# Altium schematic sheet interface2.SchDoc
size A4
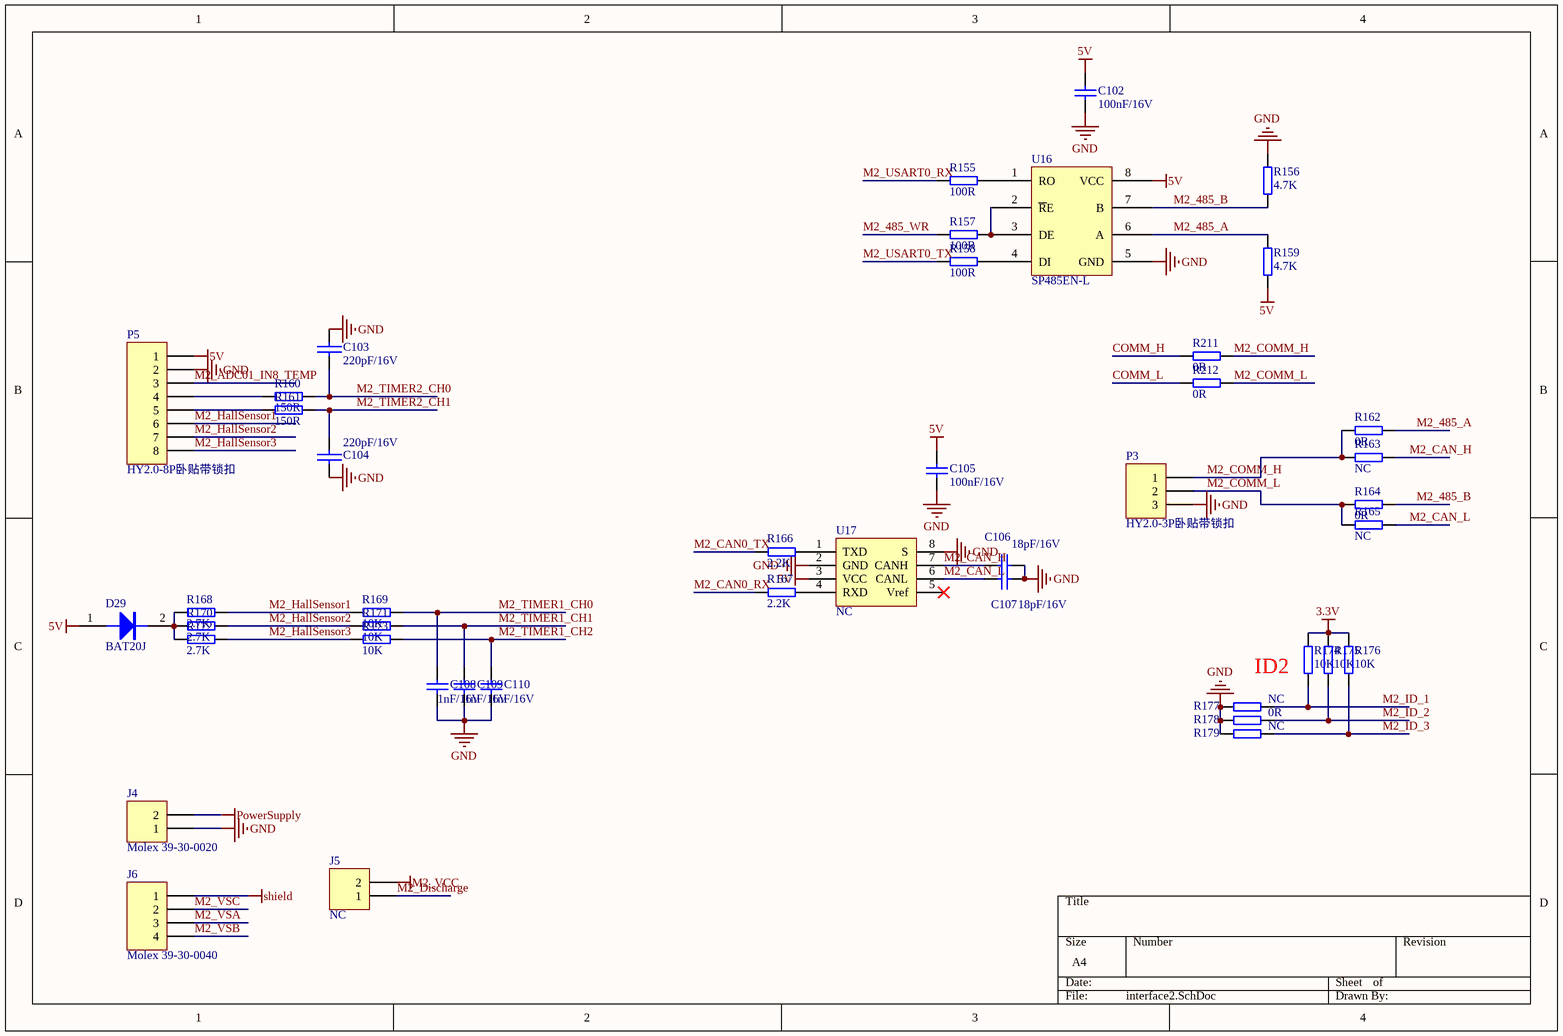
[diagram p0: interface2.SchDoc]

## Parts
C102  100nF/16V  [C0402]
C103  220pF/16V  [C0402]
C104  220pF/16V  [C0402]
C105  100nF/16V  [C0402]
C106  18pF/16V  [C0402]
C107  18pF/16V  [C0402]
C108  1nF/16V  [C0402]
C109  1nF/16V  [C0402]
C110  1nF/16V  [C0402]
D29  BAT20J  [SOD-323]
J4  Molex 39-30-0020  [Molex 39-30-0020]
J5  NC  [Molex 39-30-0020]
J6  Molex 39-30-0040  [Molex 39-30-0040]
P3  HY2.0-3P卧贴带锁扣  [2.0-3PIN 卧式]
P5  HY2.0-8P卧贴带锁扣  [2.0-8PIN 卧式]
R155  100R  [R0402]
R156  4.7K  [R0402]
R157  100R  [R0402]
R158  100R  [R0402]
R159  4.7K  [R0402]
R160  150R  [R0402]
R161  150R  [R0402]
R162  0R  [R0603]
R163  NC  [R0603]
R164  0R  [R0603]
R165  NC  [R0603]
R166  2.2K  [R0402]
R167  2.2K  [R0402]
R168  2.7K  [R0402]
R169  10K  [R0402]
R170  2.7K  [R0402]
R171  10K  [R0402]
R172  2.7K  [R0402]
R173  10K  [R0402]
R174  10K  [R0402]
R175  10K  [R0402]
R176  10K  [R0402]
R177  NC  [R0603]
R178  0R  [R0603]
R179  NC  [R0603]
R211  0R  [R0603]
R212  0R  [R0603]
U16  SP485EN-L  [SOIC-8]
U17  NC  [SOIC-8]

## Nets
3.3V: R174.2 R175.2 R176.2
5V: C102.1 C105.1 D29.1(A) P5.1 R159.1 U16.8(VCC) U17.3(VCC)
GND: C102.2 C103.2 C104.1 C105.2 C106.1 C107.1 C108.2 C109.2 C110.2 J4.1 P3.3 P5.2 R156.2 R177.2 R178.2 R179.2 U16.5(GND) U17.2(GND) U17.8(S)
M2_VCC: J5.2
PowerSupply: J4.2
shield: J6.1
COMM_H: R211.2
COMM_L: R212.2
M2_485_A: R159.2 R162.1 U16.6(A)
M2_485_B: R156.1 R164.1 U16.7(B)
M2_485_WR: R157.2
M2_ADC01_IN8_TEMP: P5.3
M2_CAN0_RX: R167.2
M2_CAN0_TX: R166.2
M2_CAN_H: C106.2 R163.1 U17.7(CANH)
M2_CAN_L: C107.2 R165.1 U17.6(CANL)
M2_COMM_H: P3.1 R162.2 R163.2 R211.1
M2_COMM_L: P3.2 R164.2 R165.2 R212.1
M2_Discharge: J5.1
M2_HallSensor1: P5.6 R168.1 R169.1
M2_HallSensor2: P5.7 R170.1 R171.1
M2_HallSensor3: P5.8 R172.1 R173.1
M2_ID_1: R174.1 R177.1
M2_ID_2: R175.1 R178.1
M2_ID_3: R176.1 R179.1
M2_TIMER1_CH0: C108.1 R169.2
M2_TIMER1_CH1: C109.1 R171.2
M2_TIMER1_CH2: C110.1 R173.2
M2_TIMER2_CH0: C103.1 R160.2
M2_TIMER2_CH1: C104.2 R161.2
M2_USART0_RX: R155.2
M2_USART0_TX: R158.2
M2_VSA: J6.3
M2_VSB: J6.4
M2_VSC: J6.2
NetD29_2: D29.2(K) R168.2 R170.2 R172.2
NetP5_4: P5.4 R160.1
NetP5_5: P5.5 R161.1
NetR155_1: R155.1 U16.1(RO)
NetR157_1: R157.1 U16.2(~{R}E) U16.3(DE)
NetR158_1: R158.1 U16.4(DI)
NetR166_1: R166.1 U17.1(TXD)
NetR167_1: R167.1 U17.4(RXD)

Not connected (* = marked no-connect by the designer): U17 5(Vref)*

## Notes on the sheet
- ID2

## Library data of the parts
C102 C105-C110 = cap
C103 C104 = CAP: Capacitor
D29 = DIODE
J4 J5 = Header 2: Molex型号39-30-0020，使用国产替代; LatestRevisionDate: 17-Jul-2002; LatestRevisionNote: Re-released for DXP Platform.; Publisher: Altium Limited
J6 = Header 4: Molex型号 39-30-0040，使用国产替代; LatestRevisionDate: 17-Jul-2002; LatestRevisionNote: Re-released for DXP Platform.; Publisher: Altium Limited
P3 = Header 3: LatestRevisionDate: 17-Jul-2002; LatestRevisionNote: Re-released for DXP Platform.; Publisher: Altium Limited
P5 = Header 8: LatestRevisionDate: 17-Jul-2002; LatestRevisionNote: Re-released for DXP Platform.; Publisher: Altium Limited
R155-R179 R211 R212 = Resistance
U16 = SP485
U17 = TJA1050: SIT1050T